# Altium schematic sheet envelope_detector.SchDoc
size A
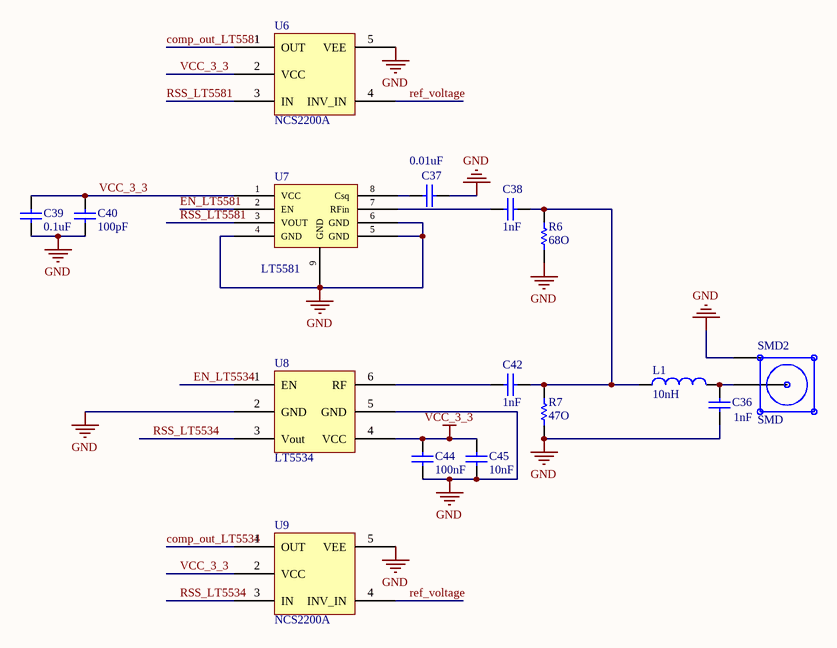
[diagram p0: envelope_detector.SchDoc]

## Parts
C36  value 1nF  [0603]  (hidden comment: Cap)
C37  value 0.01uF  [0603]  (hidden comment: Cap)
C38  value 1nF  [0603]  (hidden comment: Cap)
C39  value 0.1uF  [0603]  (hidden comment: Cap)
C40  value 100pF  [0603]  (hidden comment: Cap)
C42  value 1nF  [0603]  (hidden comment: Cap)
C44  value 100nF  [0603]  (hidden comment: Cap)
C45  value 10nF  [0603]  (hidden comment: Cap)
L1  value 10nH  [0603]  (hidden comment: Ind)
R6  value 68O  [0603]  (hidden comment: Res)
R7  value 47O  [0603]  (hidden comment: Res)
SMD2  SMD  [SMD]
U6  NCS2200A  [NCS2200]
U7  LT5581  [LT5581]
U8  LT5534  [LT5534]
U9  NCS2200A  [NCS2200]

## Nets
GND: C36.1 C37.1 C39.1 C40.1 C44.1 C45.1 R6.1 R7.1 SMD2.1 U6.5(VEE) U7.4(GND) U7.5(GND) U7.6(GND) U7.9(GND) U8.2(GND) U8.5(GND) U9.5(VEE)
VCC_3_3: C39.2 C40.2 C44.2 C45.2 U6.2(VCC) U7.1(VCC) U8.4(VCC) U9.2(VCC)
comp_out_LT5534: U9.1(OUT)
comp_out_LT5581: U6.1(OUT)
EN_LT5534: U8.1(EN)
EN_LT5581: U7.2(EN)
ref_voltage: U6.4(INV_IN) U9.4(INV_IN)
RSS_LT5534: U8.3(Vout) U9.3(IN)
RSS_LT5581: U6.3(IN) U7.3(VOUT)
NetC36_2: C36.2 L1.2 SMD2.2
NetC37_2: C37.2 U7.8(Csq)
NetC38_1: C38.1 U7.7(RFin)
NetC38_2: C38.2 C42.2 L1.1 R6.2 R7.2
NetC42_1: C42.1 U8.6(RF)

## Library data of the parts
C36-C40 C42 C44 C45 = Cap: Ceramic Capacitor (Surface Mount); Manufacturer: Generic Ceramic Chip Cap (TBD); Digi-Key Part Number: *; Manufacturer Part Number: *; Note: *; Rating: *
L1 = Ind: Inductor (Surface Mount); Digi-Key Part Number: *; Manufacturer: *; Manufacturer Part Number: *; Rating: *; Note: *
R6 R7 = Res: Chip Resistor (Surface Mount); Manufacturer: Generic Chip Res (TBD); Manufacturer Part Number: *; Digi-Key Part Number: *; Rating: *